# EAGLE schematic ReflexHammerSchematic (EAGLE 9.6.0)
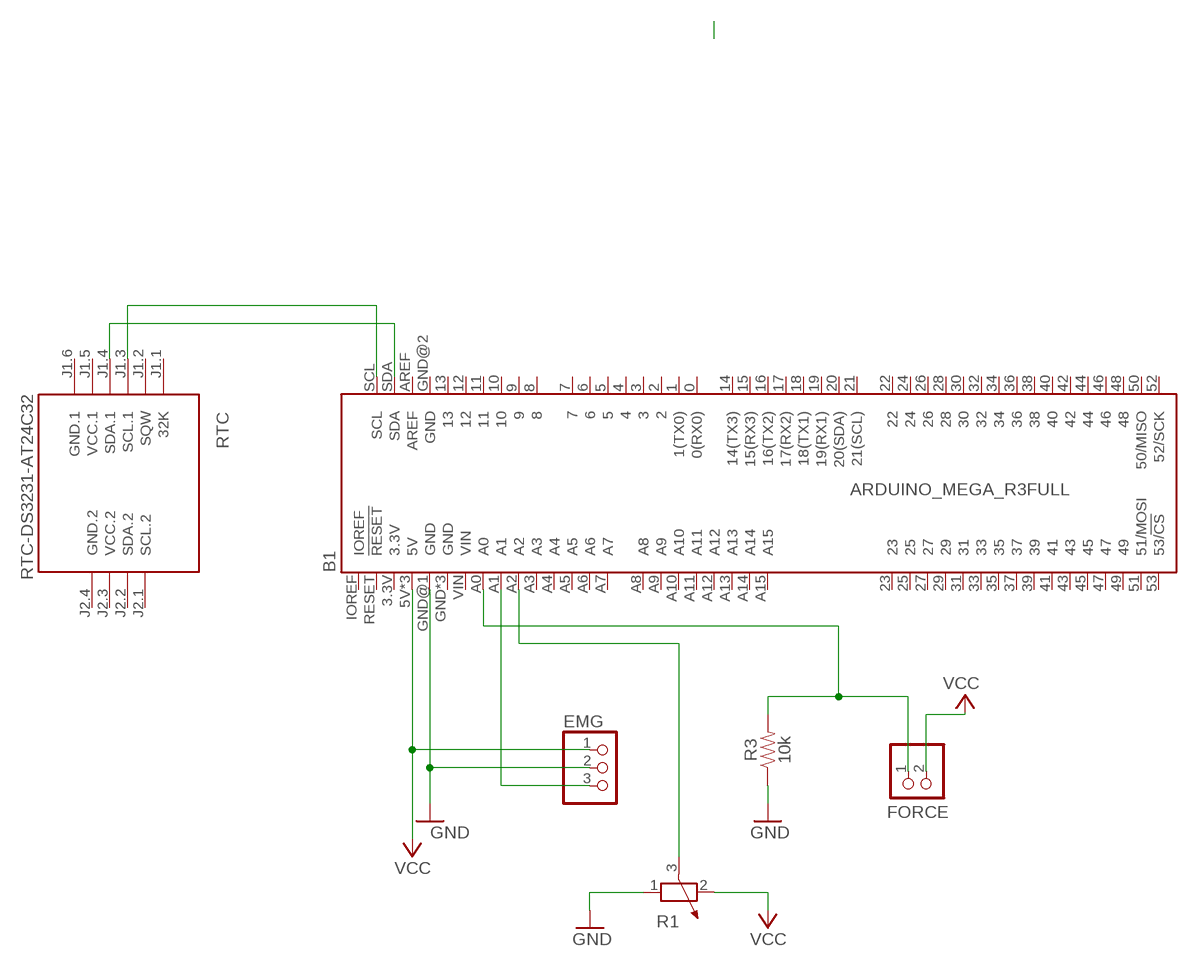
[diagram p0: schematic, sheet 1]

## Parts
B1  ARDUINO_MEGA_R3FULL  [ARDUINO_MEGA_NO_SILK]
EMG  PINHD-1X3  [1X03]
FORCE  JST_2PIN-SMT  [JST-PH-2-SMT]
R1  POTENTIOMETER_PT-10  [PT-10]
R3  10k  10KOHM-0402-1/16W-1%  [0402]
RTC  RTC-DS3231-AT24C32  [RTC-DS3231-AT24C32]

## Nets
GND: B1.GND@1(GND) EMG.2 R1.1 R3.1
N$1: B1.A0 FORCE.1 R3.2
N$2: B1.A1 EMG.3
N$3: B1.A2 R1.3
N$14: B1.SDA RTC.J1.4(SDA.1)
N$15: B1.SCL RTC.J1.3(SCL.1)
VCC: B1.5V B1.5V@1(5V) B1.5V@2(5V) EMG.1 FORCE.2 R1.2
Unconnected: B1.0(0(RX0)) B1.1(1(TX0)) B1.2 B1.3 B1.3.3V B1.4 B1.5 B1.6 B1.7 B1.8 B1.9 B1.10 B1.11 B1.12 B1.13 B1.14(14(TX3)) B1.15(15(RX3)) B1.16(16(TX2)) B1.17(17(RX2)) B1.18(18(TX1)) B1.19(19(RX1)) B1.20(20(SDA)) B1.21(21(SCL)) B1.22 B1.23 B1.24 B1.25 B1.26 B1.27 B1.28 B1.29 B1.30 B1.31 B1.32 B1.33 B1.34 B1.35 B1.36 B1.37 B1.38 B1.39 B1.40 B1.41 B1.42 B1.43 B1.44 B1.45 B1.46 B1.47 B1.48 B1.49 B1.50(50/MISO) B1.51(51/MOSI) B1.52(52/SCK) B1.53(53/!CS) B1.A3 B1.A4 B1.A5 B1.A6 B1.A7 B1.A8 B1.A9 B1.A10 B1.A11 B1.A12 B1.A13 B1.A14 B1.A15 B1.AREF B1.GND B1.GND@2(GND) B1.GND@3(GND) B1.GND@4(GND) B1.IOREF B1.RESET(!RESET) B1.VIN RTC.J1.1(32K) RTC.J1.2(SQW) RTC.J2.1(SCL.2) RTC.J2.2(SDA.2)

## Power pins joined to a net without a drawn wire
GND.1: RTC.J1.6(GND.1)
GND.2: RTC.J2.4(GND.2)
VCC.1: RTC.J1.5(VCC.1)
VCC.2: RTC.J2.3(VCC.2)

## Library data of the parts
B1 = SparkFun-Boards:ARDUINO_MEGA_R3: Arduino Mega R3 ATmega2560 R3 compatible footprint. SparkFun Products: Arduino Mega 2560 R3 <https://www.sparkfun.com/products/11061>
EMG = adafruit:PINHD-1X3: PIN HEADER
FORCE = adafruit:JST_2PIN: JST 2-Pin Connectors of various flavors SMT-RA (S2B-PH-SM4) 4UConnector #17311 SMT (B2B-PH-SM4) THM-RA (S2B-PH) THM (B2B-PH)
R1 = rcl:POTENTIOMETER_: Potentiometer; SPICEMODEL: POT; SPICEPREFIX: X
R3 = SparkFun-Resistors:10KOHM: 10kΩ resistor A resistor is a passive two-terminal electrical component that implements electrical resistance as a circuit element. Resistors act to reduce current flow, and, at the same time, act to lower voltage levels within circuits. - Wikipedia; PROD_ID: RES-14241
RTC = diy-modules:RTC-DS3231-AT24C32: RTC Module with Battery and EEPROM based on DS3231 and AT24C32 chips Tutorial can be found here: https://edwardmallon.wordpress.com/2014/05/21/using-a-cheap-3-ds3231-rtc-at24c32-eeprom-from-ebay/ Click here to find device on ebay.com <http://www.ebay.com/sch/DS3231+AT24C32+module>